# EAGLE schematic board (EAGLE 9.5.2)
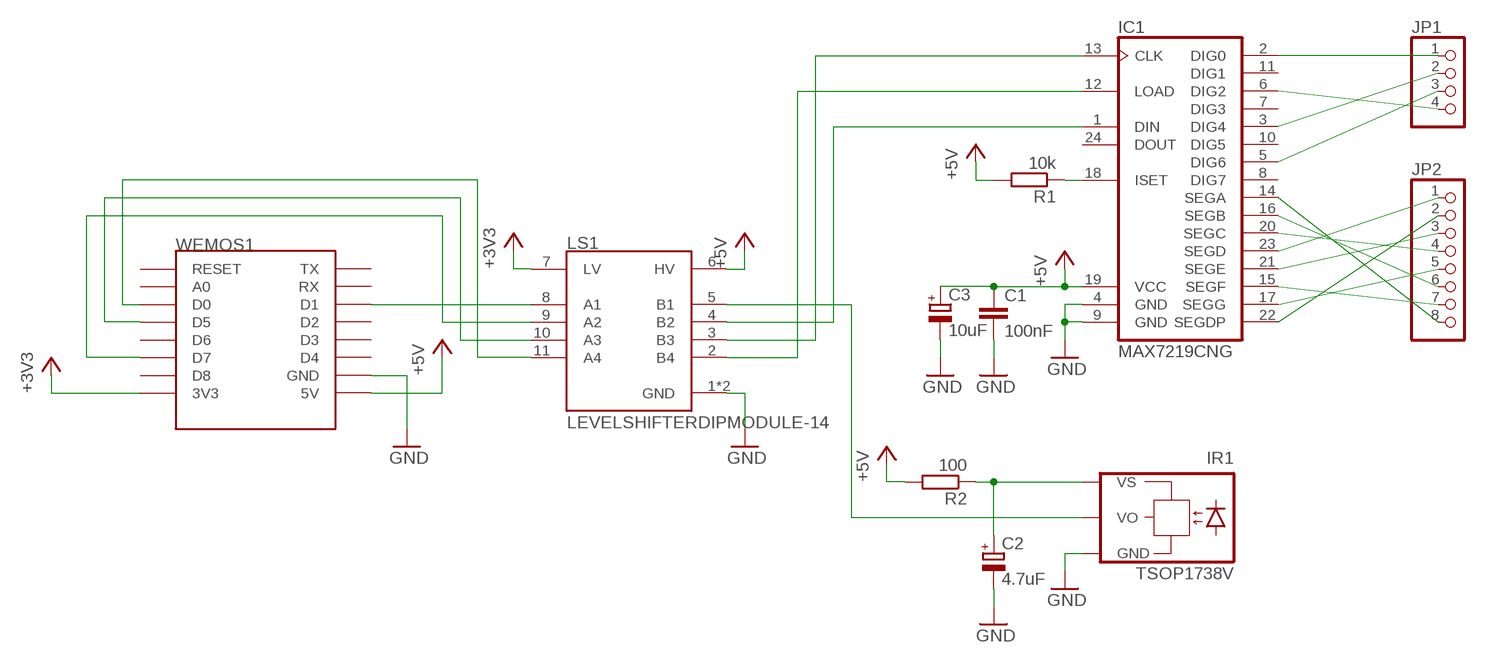
[diagram p0: schematic, sheet 1]

## Parts
C1  100nF  C-EU050-024X044  [C050-024X044]
C2  4.7uF  CPOL-EUE1.8-4  [E1,8-4]
C3  10uF  CPOL-EUE1.8-4  [E1,8-4]
IC1  MAX7219CNG  [DIL24-3]
IR1  TSOP1738V  [TSOP17_V]
JP1  PINHD-1X4  [1X04]
JP2  PINHD-1X8  [1X08]
LS1  LEVELSHIFTERDIPMODULE-14  [DIP1016W53P254L1969H508Q12B]
R1  10k  R-EU_0207/10  [0207/10]
R2  100  R-EU_0207/10  [0207/10]
WEMOS1  WEMOS-D1-MINI  [WEMOS-D1-MINI]

## Nets
+3V3: LS1.7(LV) WEMOS1.3V3
+5V: C1.1 C3.+ IC1.19(VCC) LS1.6(HV) R1.2 R2.2 WEMOS1.5V
GND: C1.2 C2.- C3.- IC1.4(GND) IC1.9(GND) IR1.GND LS1.1(GND) LS1.12(GND) WEMOS1.GND
N$1: LS1.9(A2) WEMOS1.D7
N$2: LS1.10(A3) WEMOS1.D5
N$3: LS1.8(A1) WEMOS1.D1
N$4: IR1.VO LS1.5(B1)
N$5: IC1.1(DIN) LS1.4(B2)
N$6: IC1.13(CLK) LS1.3(B3)
N$7: IC1.12(LOAD) LS1.2(B4)
N$8: LS1.11(A4) WEMOS1.D0
N$9: IC1.18(ISET) R1.1
N$10: IC1.2(DIG0) JP1.1
N$11: IC1.3(DIG4) JP1.2
N$12: IC1.5(DIG6) JP1.3
N$13: IC1.6(DIG2) JP1.4
N$14: IC1.23(SEGD) JP2.1
N$15: IC1.22(SEGDP) JP2.2
N$16: IC1.21(SEGE) JP2.3
N$17: IC1.20(SEGC) JP2.4
N$18: IC1.17(SEGG) JP2.5
N$19: IC1.16(SEGB) JP2.6
N$20: IC1.15(SEGF) JP2.7
N$21: IC1.14(SEGA) JP2.8
N$22: C2.+ IR1.VS R2.1
Unconnected: IC1.7(DIG3) IC1.8(DIG7) IC1.10(DIG5) IC1.11(DIG1) IC1.24(DOUT) WEMOS1.A0 WEMOS1.D2 WEMOS1.D3 WEMOS1.D4 WEMOS1.D6 WEMOS1.D8 WEMOS1.RESET WEMOS1.RX WEMOS1.TX

## Library data of the parts
C1 = rcl:C-EU: CAPACITOR, European symbol; SPICEPREFIX: C
C2 C3 = rcl:CPOL-EU: POLARIZED CAPACITOR, European symbol; SPICEPREFIX: C
IC1 = maxim:MAX7219CNG: LED DISPLAY DRIVER; MF: MAXIM; MPN: MAX7219CNG; OC_FARNELL: 1523914; OC_NEWARK: 34C4018
IR1 = telefunken:TSOP17*: TSOP17..TB1 IR Receiver Modules for Remote Control Systems Source: http://www.vishay.com/docs/82042/82042.pdf
JP1 = pinhead:PINHD-1X4: PIN HEADER
JP2 = pinhead:PINHD-1X8: PIN HEADER
LS1 = parts:LEVELSHIFTER
R1 R2 = rcl:R-EU_: RESISTOR, European symbol; SPICEPREFIX: R
WEMOS1 = esp8266modules:WEMOS-D1-MINI: WeMos.cc D1 mini ESP8266 module